# EAGLE design blues-hardware (EAGLE 9.5.0)
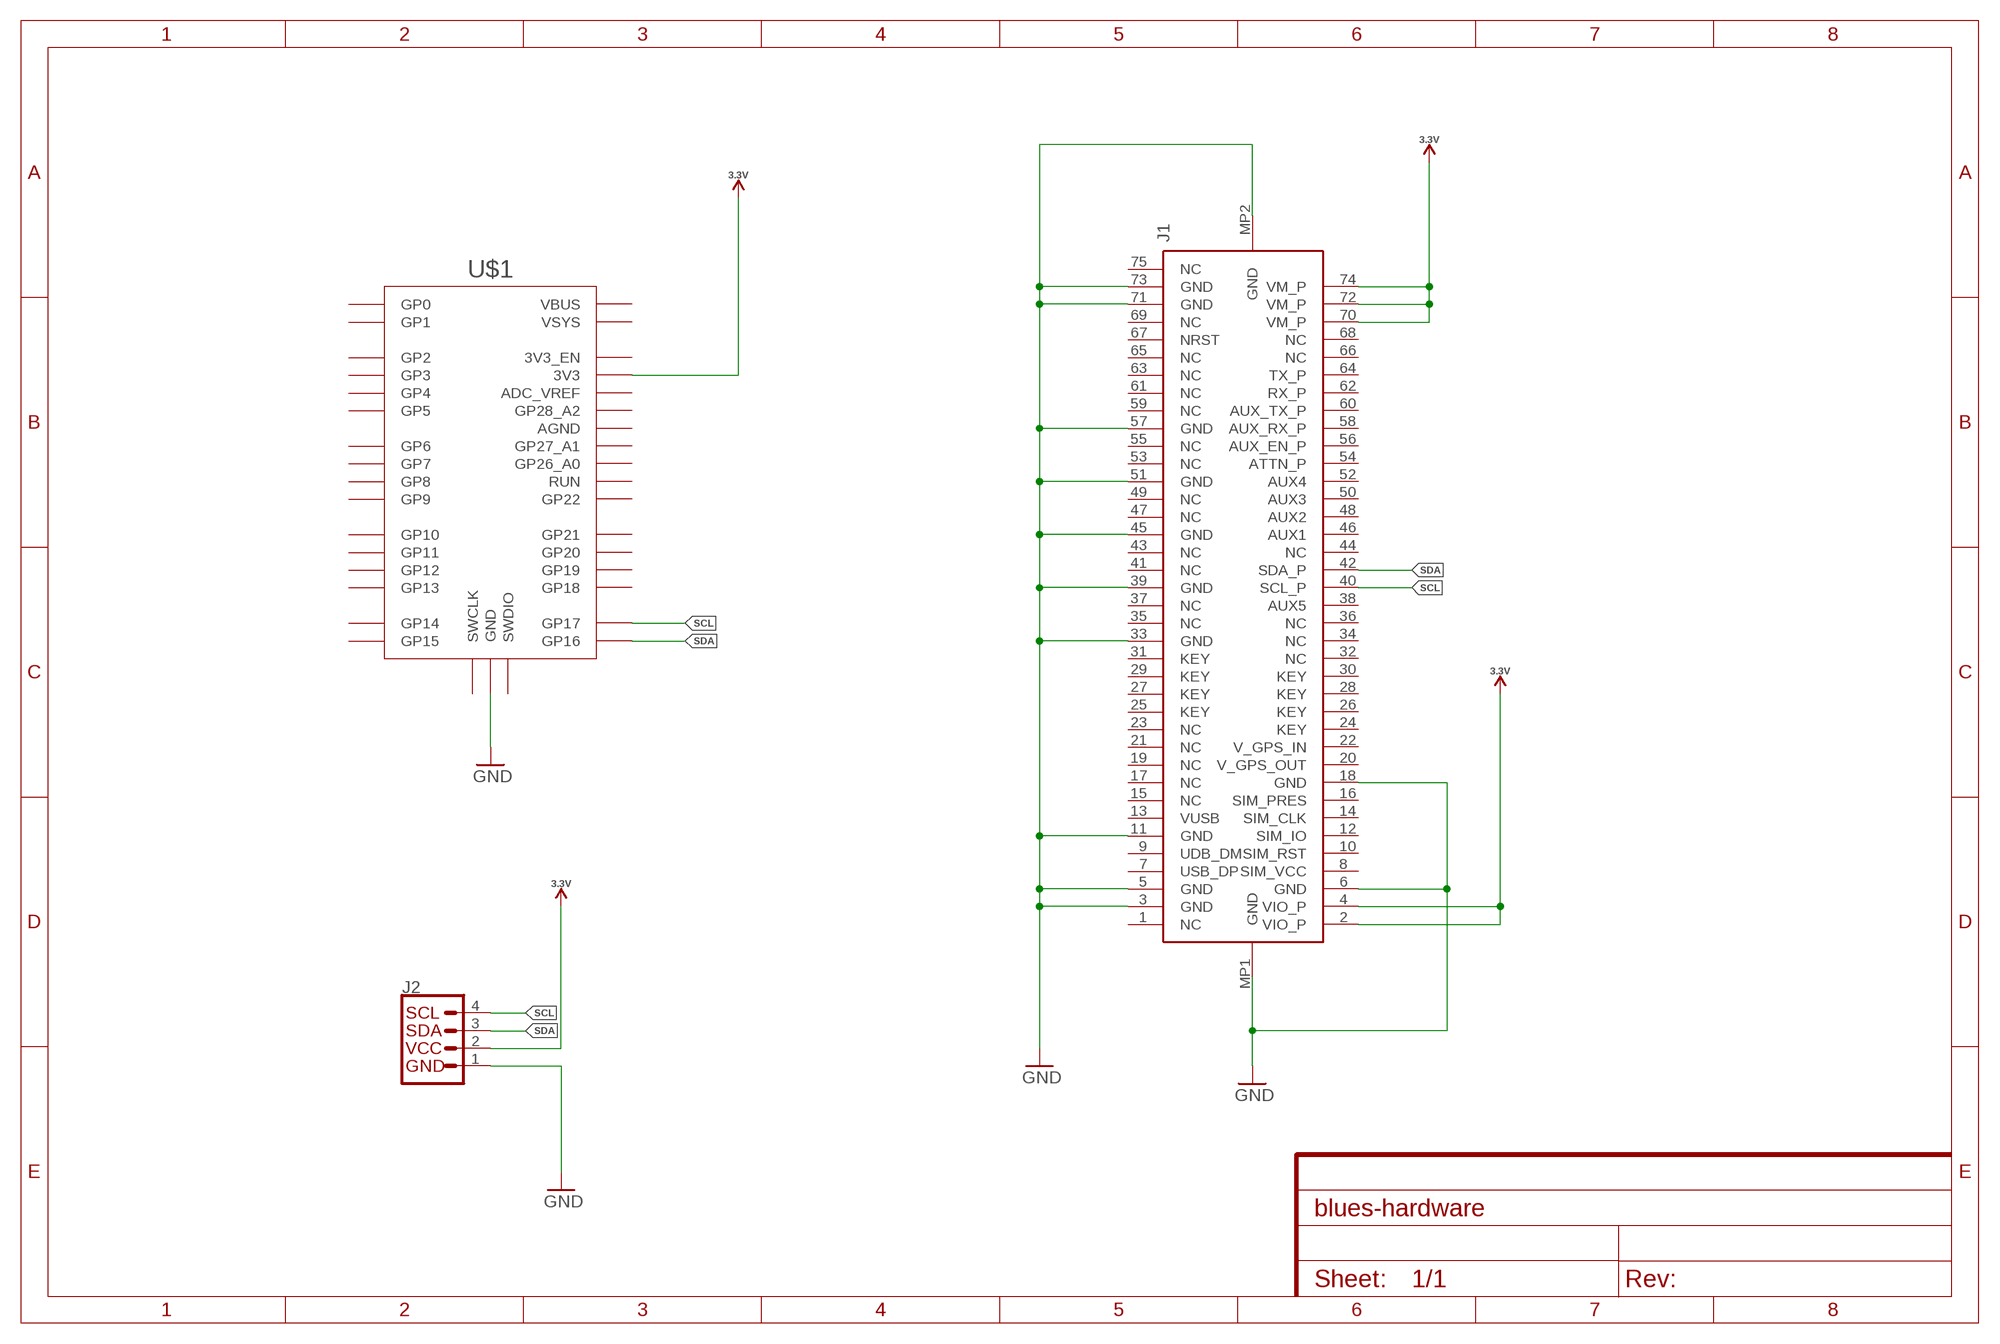
[diagram p0: schematic, sheet 1]

## Parts
J1  MDT420E01001NOTECARD  [NOTECARD]
J2  QWIIC_CONNECTORJS-1MM  [1X04_1MM_RA]
U$1  RPI_PICO-TH  [RPI_PICO_TH]

## Nets
3.3V: J1.2(VIO_P) J1.4(VIO_P) J1.70(VM_P) J1.72(VM_P) J1.74(VM_P) J2.2 U$1.3V3
GND: J1.3(GND) J1.5(GND) J1.6(GND) J1.11(GND) J1.18(GND) J1.33(GND) J1.39(GND) J1.45(GND) J1.51(GND) J1.57(GND) J1.71(GND) J1.73(GND) J1.MP1(GND) J1.MP2(GND) J2.1 U$1.GND@1(GND) U$1.GND@2(GND) U$1.GND@3(GND) U$1.GND@4(GND) U$1.GND@5(GND) U$1.GND@6(GND) U$1.GND@7(GND) U$1.GND@8(GND)
SCL: J1.40(SCL_P) J2.4 U$1.GP17
SDA: J1.42(SDA_P) J2.3 U$1.GP16
Unconnected: J1.1(NC) J1.7(USB_DP) J1.8(SIM_VCC) J1.9(UDB_DM) J1.10(SIM_RST) J1.12(SIM_IO) J1.13(VUSB) J1.14(SIM_CLK) J1.15(NC) J1.16(SIM_PRES) J1.17(NC) J1.19(NC) J1.20(V_GPS_OUT) J1.21(NC) J1.22(V_GPS_IN) J1.23(NC) J1.24(KEY) J1.25(KEY) J1.26(KEY) J1.27(KEY) J1.28(KEY) J1.29(KEY) J1.30(KEY) J1.31(KEY) J1.32(NC) J1.34(NC) J1.35(NC) J1.36(NC) J1.37(NC) J1.38(AUX5) J1.41(NC) J1.43(NC) J1.44(NC) J1.46(AUX1) J1.47(NC) J1.48(AUX2) J1.49(NC) J1.50(AUX3) J1.52(AUX4) J1.53(NC) J1.54(ATTN_P) J1.55(NC) J1.56(AUX_EN_P) J1.58(AUX_RX_P) J1.59(NC) J1.60(AUX_TX_P) J1.61(NC) J1.62(RX_P) J1.63(NC) J1.64(TX_P) J1.65(NC) J1.66(NC) J1.67(NRST) J1.68(NC) J1.69(NC) J1.75(NC) U$1.3V3_EN U$1.ADC_VREF U$1.AGND U$1.GP0 U$1.GP1 U$1.GP2 U$1.GP3 U$1.GP4 U$1.GP5 U$1.GP6 U$1.GP7 U$1.GP8 U$1.GP9 U$1.GP10 U$1.GP11 U$1.GP12 U$1.GP13 U$1.GP14 U$1.GP15 U$1.GP18 U$1.GP19 U$1.GP20 U$1.GP21 U$1.GP22 U$1.GP26_A0 U$1.GP27_A1 U$1.GP28_A2 U$1.RUN U$1.SWCLK U$1.SWDIO U$1.VBUS U$1.VSYS

## Library data of the parts
J1 = notecard:MDT420E01001: PCI Express / PCI Connectors 67P SMT RCPT H4.20 E Key, 30u" Au Source: Datasheet <https://componentsearchengine.com/Datasheets/1/MDT420E01001.pdf>
J2 = SparkFun-Connectors:QWIIC_CONNECTOR: SparkFun I2C Standard Qwiic Connector An SMD 1mm pitch JST connector makes it easy and quick (get it? Qwiic?) to connect I2C devices to each other. The Qwiic system <http://www.sparkfun.com/qwiic> enables fast and solderless connection between popular platforms and various sensors and actuators. We carry 200mm <https://www.sparkfun.com/products/14204>, 100mm <https://www.sparkfun.com/products/14205>, 50mm <https://www.sparkfun.com/products/14206>, and breadboard friendly <https://www.sparkfun.com/products/14207> Qwiic cables. We also offer 10 pcs strips <https://www.sparkfun.com/products/14323> the SMD connectors.; PROD_ID: CONN-13694
U$1 = RaspberryPi_Pico:RPI_PICO

## Board
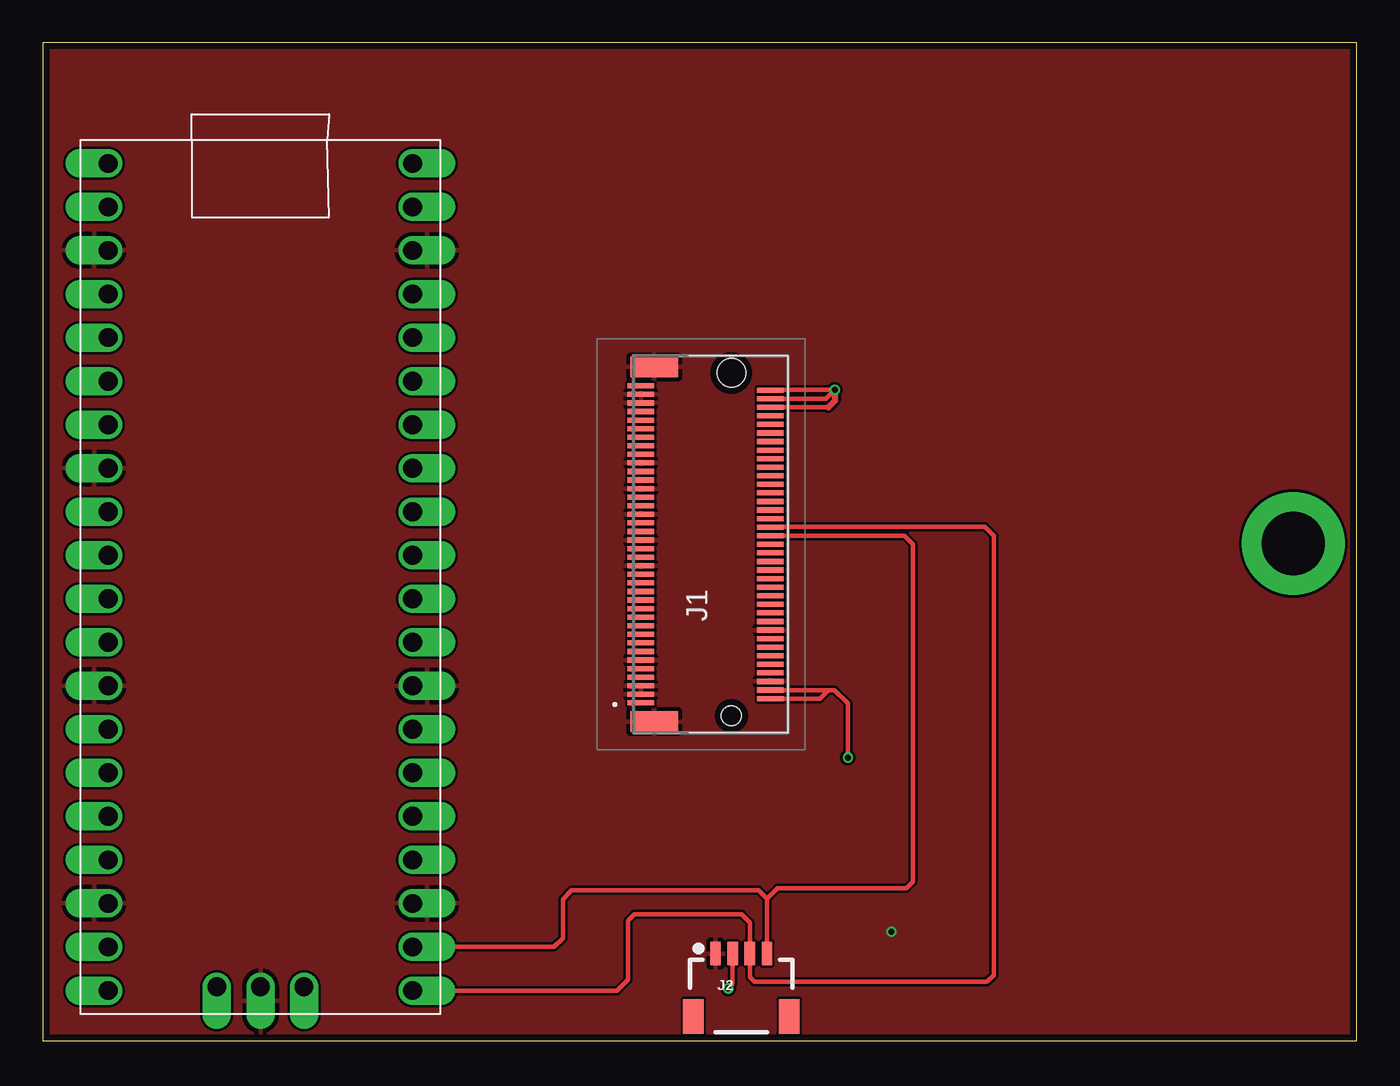
[diagram p1: board, top side]
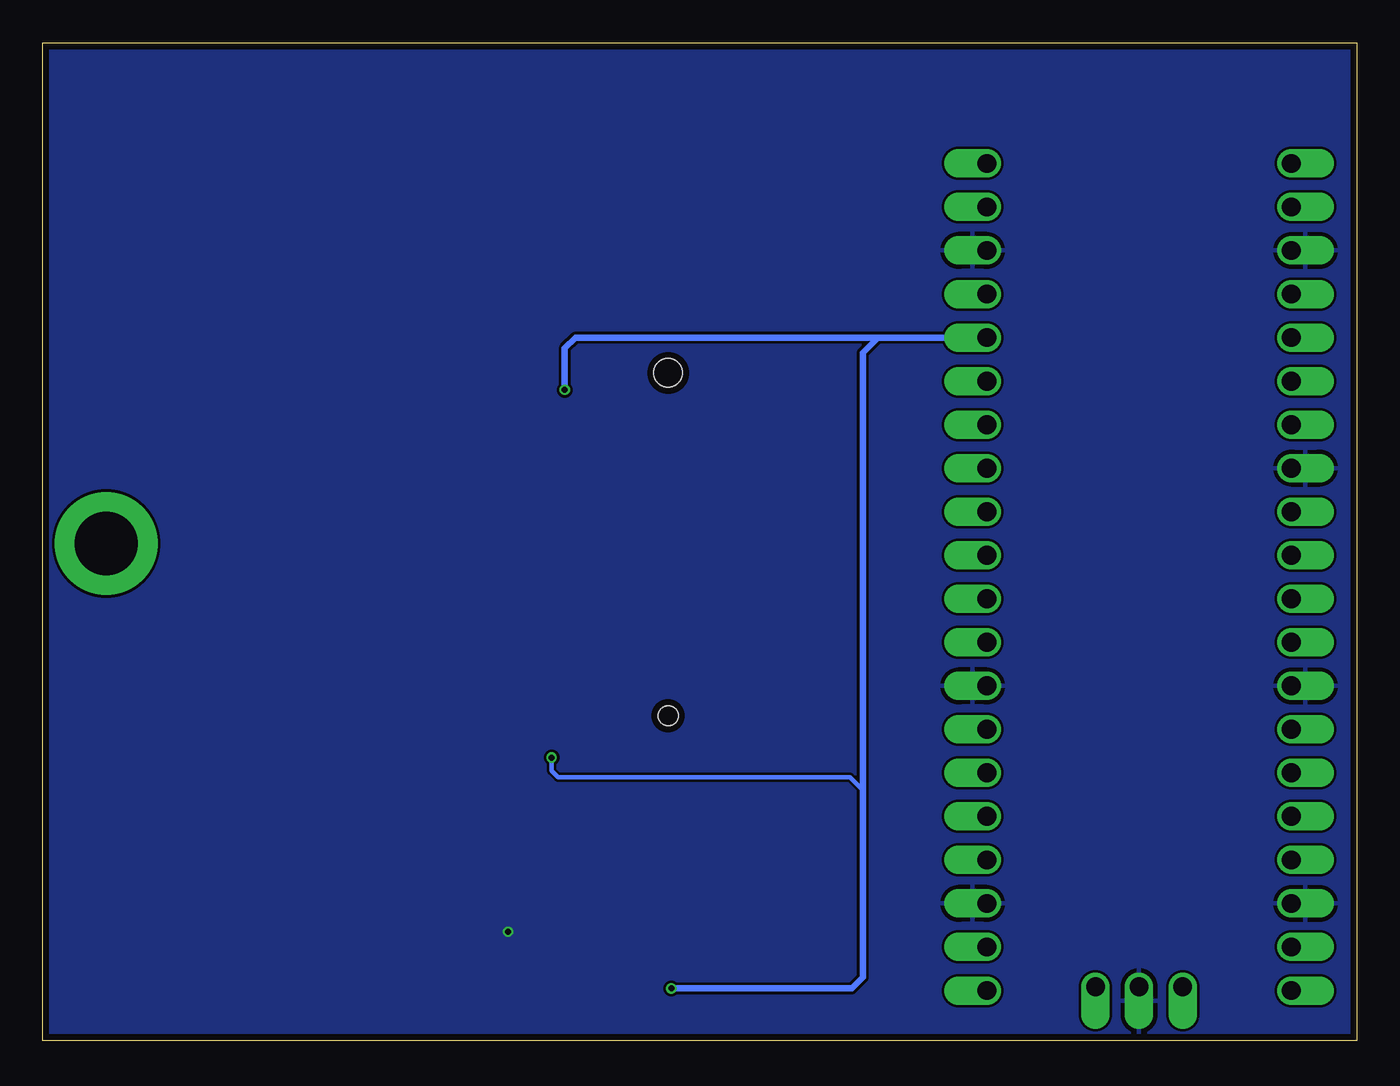
[diagram p2: board, bottom side, seen from below]

Size 76.69 x 58.22 mm. Coordinates in mm from the lower left corner, seen from the top.
Outline: 0,0 76.69,0 76.69,58.22 0,58.22 0,0
Copper layers (1*16): Top 0.035559375mm / dielectric 1.6mm / Bottom 0.035559375mm
Design rules "oshpark-2layer": minimum track width 6mil, minimum drill 10mil, track to track 6mil, track to pad 6mil, pad to pad 6mil, via to via 6mil, smd to smd 6mil, copper to edge 15mil, drill to drill 6mil, minimum pad ring 5mil, minimum via ring 5mil, stop-mask expansion 2.5mil, vias tented up to drill 0mil, thermal gap 10mil

### Footprints (pad centres in the part's own frame; a part is rotated, then mirrored left to right if it is on the bottom)
NOTECARD = smd 0.3 x 1.55: 1 -9.25,4.075; 2 -9,-3.475; 3 -8.75,4.075; 4 -8.5,-3.475; 5 -8.25,4.075; 6 -8,-3.475; 7 -7.75,4.075; 8 -7.5,-3.475; 9 -7.25,4.075; 10 -7,-3.475; 11 -6.75,4.075; 12 -6.5,-3.475; 13 -6.25,4.075; 14 -6,-3.475; 15 -5.75,4.075; 16 -5.5,-3.475; 17 -5.25,4.075; 18 -5,-3.475; 19 -4.75,4.075; 20 -4.5,-3.475; 21 -4.25,4.075; 22 -4,-3.475; 23 -3.75,4.075; 24 -3.5,-3.475; 25 -3.25,4.075; 26 -3,-3.475; 27 -2.75,4.075; 28 -2.5,-3.475; 29 -2.25,4.075; 30 -2,-3.475; 31 -1.75,4.075; 32 -1.5,-3.475; 33 -1.25,4.075; 34 -1,-3.475; 35 -0.75,4.075; 36 -0.5,-3.475; 37 -0.25,4.075; 38 0,-3.475; 39 0.25,4.075; 40 0.5,-3.475; 41 0.75,4.075; 42 1,-3.475; 43 1.25,4.075; 44 1.5,-3.475; 45 1.75,4.075; 46 2,-3.475; 47 2.25,4.075; 48 2.5,-3.475; 49 2.75,4.075; 50 3,-3.475; 51 3.25,4.075; 52 3.5,-3.475; 53 3.75,4.075; 54 4,-3.475; 55 4.25,4.075; 56 4.5,-3.475; 57 4.75,4.075; 58 5,-3.475; 59 5.25,4.075; 60 5.5,-3.475; 61 5.75,4.075; 62 6,-3.475; 63 6.25,4.075; 64 6.5,-3.475; 65 6.75,4.075; 66 7,-3.475; 67 7.25,4.075; 68 7.5,-3.475; 69 7.75,4.075; 70 8,-3.475; 71 8.25,4.075; 72 8.5,-3.475; 73 8.75,4.075; 74 9,-3.475; 75 9.25,4.075 | smd 1.2 x 2.75: MP1 -10.35,3.3; MP2 10.35,3.3 | drill 3.7 pad 6: P$1 0.05,-34 | hole 1.15: -10,-1.2 | hole 1.65: 10,-1.2
1X04_1MM_RA = smd 0.6 x 1.35: 1 -1.5,0; 2 -0.5,0; 3 0.5,0; 4 1.5,0 | smd 1.2 x 2: NC1 2.8,-3.675; NC2 -2.8,-3.675
RPI_PICO_TH = drill 1.1 pad 1.6 offset: 3V3 8.89,13.97; 3V3_EN 8.89,16.51; ADC_VREF 8.89,11.43; AGND 8.89,6.35; GND@1 -8.89,19.05; GND@2 -8.89,6.35; GND@3 -8.89,-6.35; GND@4 -8.89,-19.05; GND@5 0,-23.9; GND@6 8.89,-19.05; GND@7 8.89,-6.35; GND@8 8.89,19.05; GP0 -8.89,24.13; GP1 -8.89,21.59; GP2 -8.89,16.51; GP3 -8.89,13.97; GP4 -8.89,11.43; GP5 -8.89,8.89; GP6 -8.89,3.81; GP7 -8.89,1.27; GP8 -8.89,-1.27; GP9 -8.89,-3.81; GP10 -8.89,-8.89; GP11 -8.89,-11.43; GP12 -8.89,-13.97; GP13 -8.89,-16.51; GP14 -8.89,-21.59; GP15 -8.89,-24.13; GP16 8.89,-24.13; GP17 8.89,-21.59; GP18 8.89,-16.51; GP19 8.89,-13.97; GP20 8.89,-11.43; GP21 8.89,-8.89; GP22 8.89,-3.81; GP26_A0 8.89,1.27; GP27_A1 8.89,3.81; GP28_A2 8.89,8.89; RUN 8.89,-1.27; SWCLK -2.54,-23.9; SWDIO 2.54,-23.9; VBUS 8.89,24.13; VSYS 8.89,21.59

### Placement (x,y rotation side)
J1  38.99,28.96 90 top
J2  40.77,5.08 0 top
U$1  12.7,27.05 0 top

### Tracks (layer width: path | path; a pad name or v marks a point on that pad's centre or on a via)
3.3V  (via drill 0.35)
  Top 0.254: 45.85,36.96 J1.70 | J1.72 45.71,37.46 v46.23,37.97 42.48,37.97 J1.74 | J2.2 40.27,3.31 v40.01,3.05 | J1.4 45.85,20.46 | 45.85,20.46 46.22,20.46 46.99,19.68 v46.99,16.51 | J1.2 45.35,19.96 45.85,20.46
  Top 0.381: v46.23,37.97 46.23,37.34 45.85,36.96
  Bottom 0.254: v46.99,16.51 46.99,15.75 46.61,15.37 29.59,15.37 28.83,14.61
  Bottom 0.381: U$1.3V3 27.94,41.02 | 27.94,41.02 45.59,41.02 46.23,40.39 v46.23,37.97 | v40.01,3.05 29.46,3.05 28.83,3.68 28.83,14.61 28.83,40.13 27.94,41.02
GND  (via drill 0.35)
  other vias: 49.53,6.35
  pour Top: 0,0 0,58.17 76.71,58.17 76.71,0
  pour Bottom: 0,0 0,58.17 76.71,58.17 76.71,0
SCL
  Top 0.254: J2.4 42.27,8.28 | 42.27,8.28 41.78,8.76 30.86,8.76 30.35,8.26 30.35,5.97 29.84,5.46 U$1.GP17 | 42.27,8.28 42.88,8.89 50.42,8.89 50.8,9.27 50.8,28.96 50.29,29.46 42.47,29.46 J1.40
SDA
  Top 0.254: U$1.GP16 33.53,2.92 34.16,3.56 34.16,6.99 34.54,7.37 40.77,7.37 41.27,6.87 J2.3 41.27,3.69 41.53,3.43 55.12,3.43 55.5,3.81 55.5,29.46 54.99,29.97 42.48,29.97 J1.42